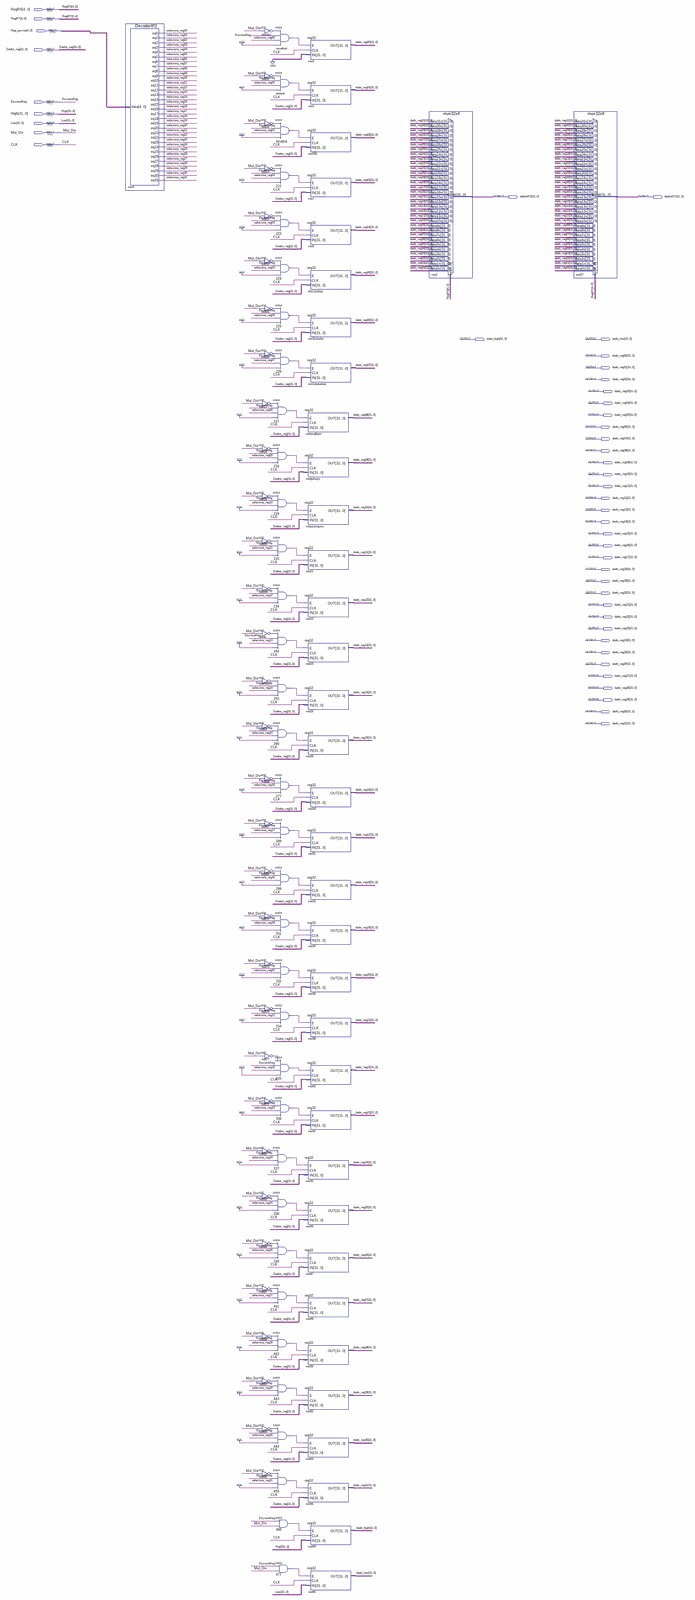
[diagram p0: schematic sheet, whole]
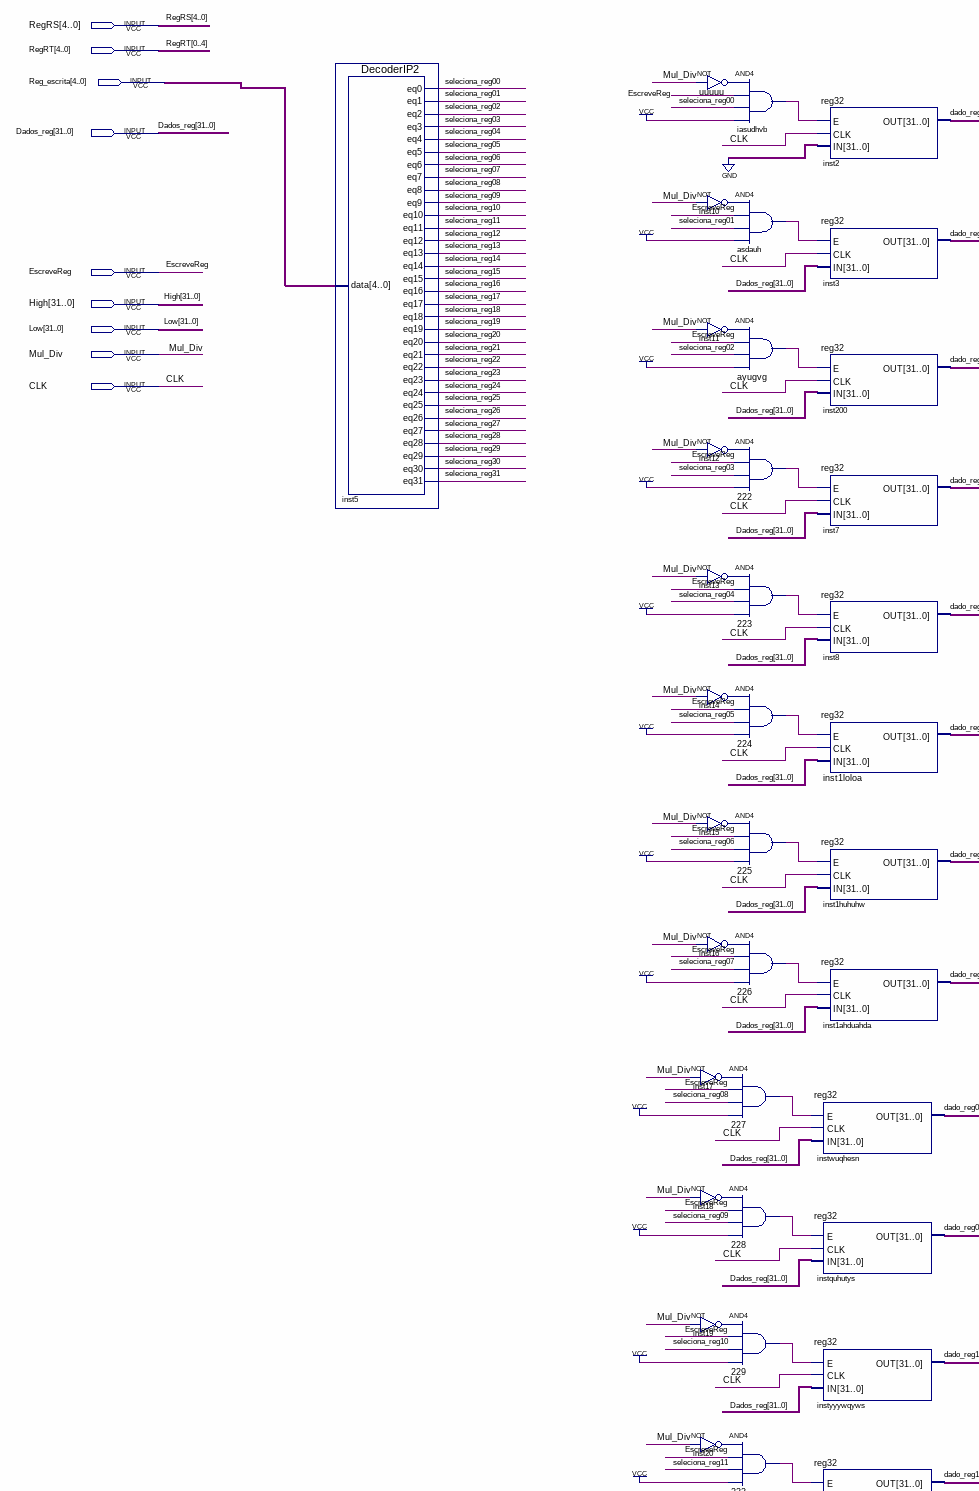
[diagram p1: schematic sheet, upper left part]
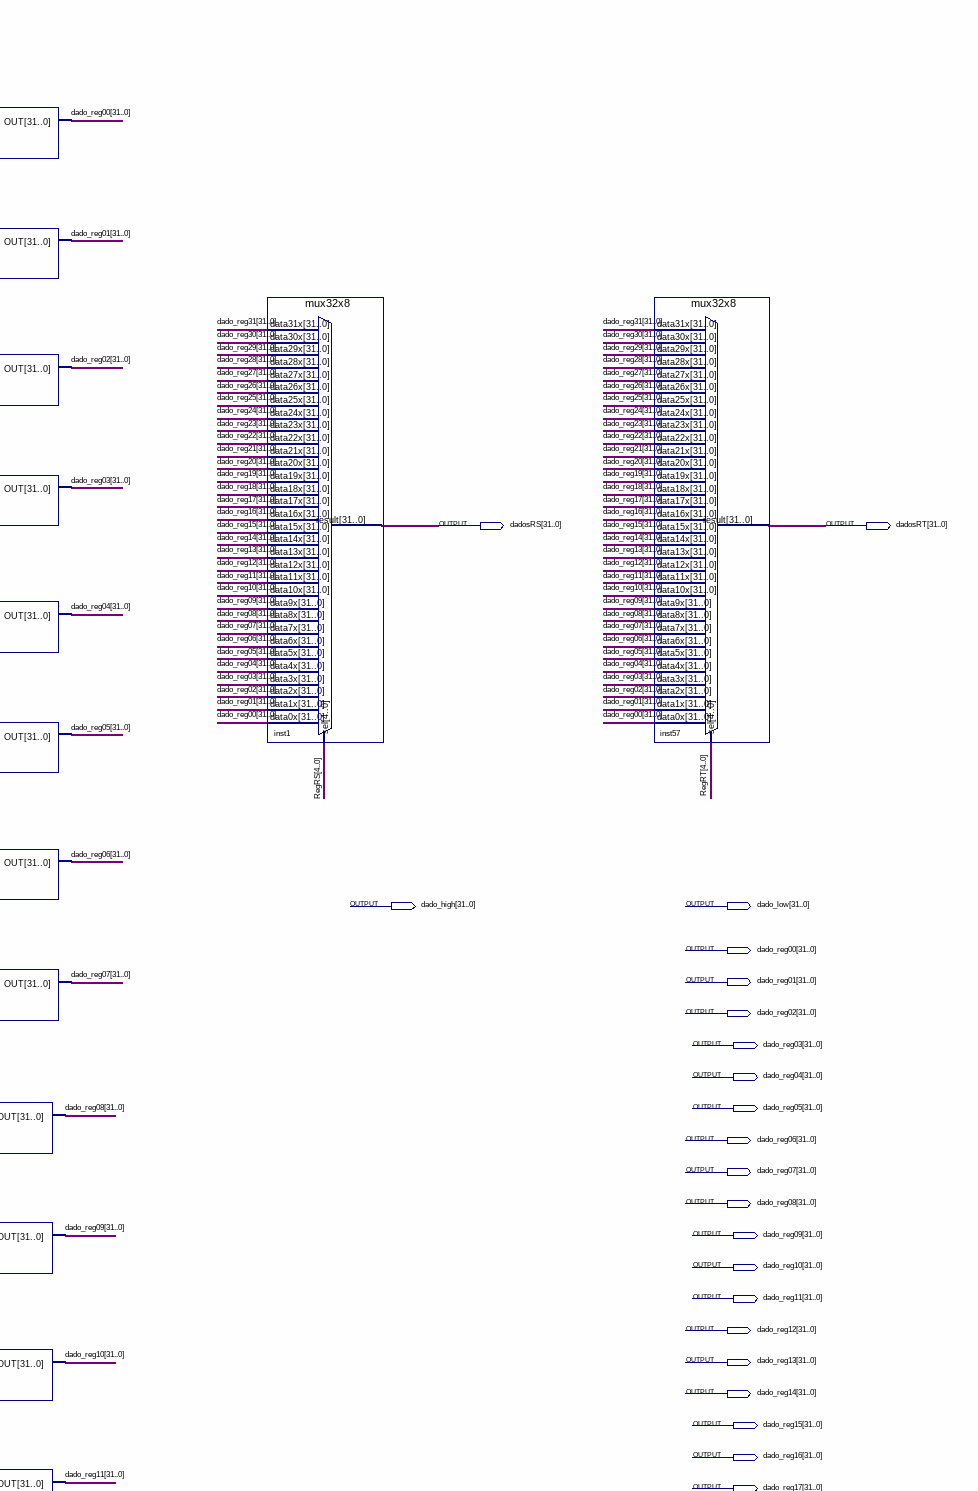
[diagram p2: schematic sheet, upper right part]
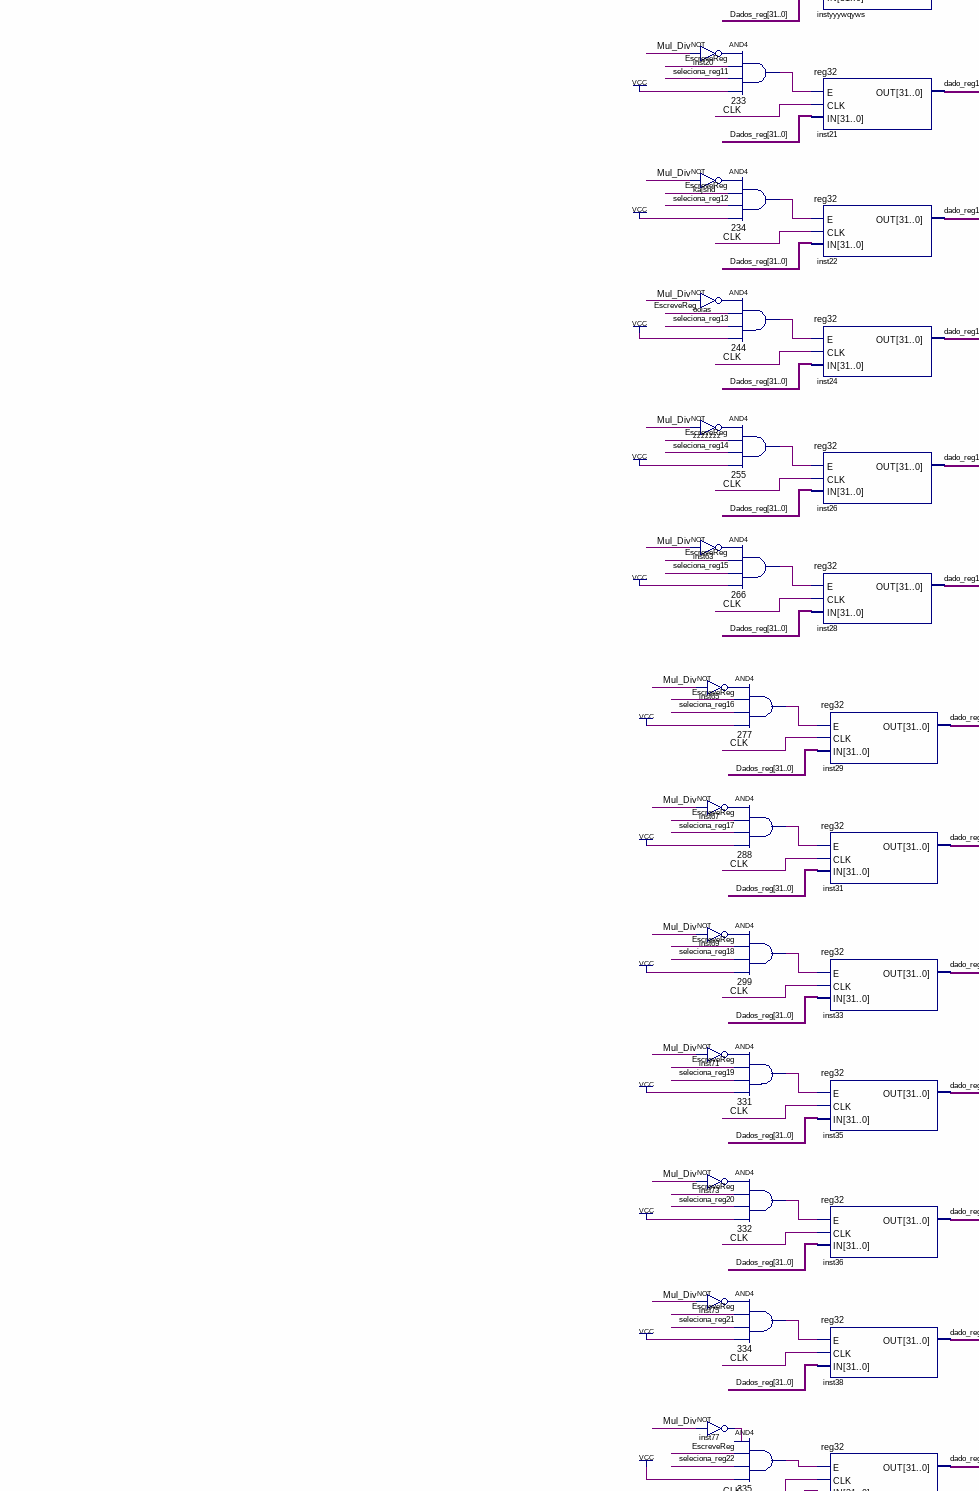
[diagram p3: schematic sheet, middle left part]
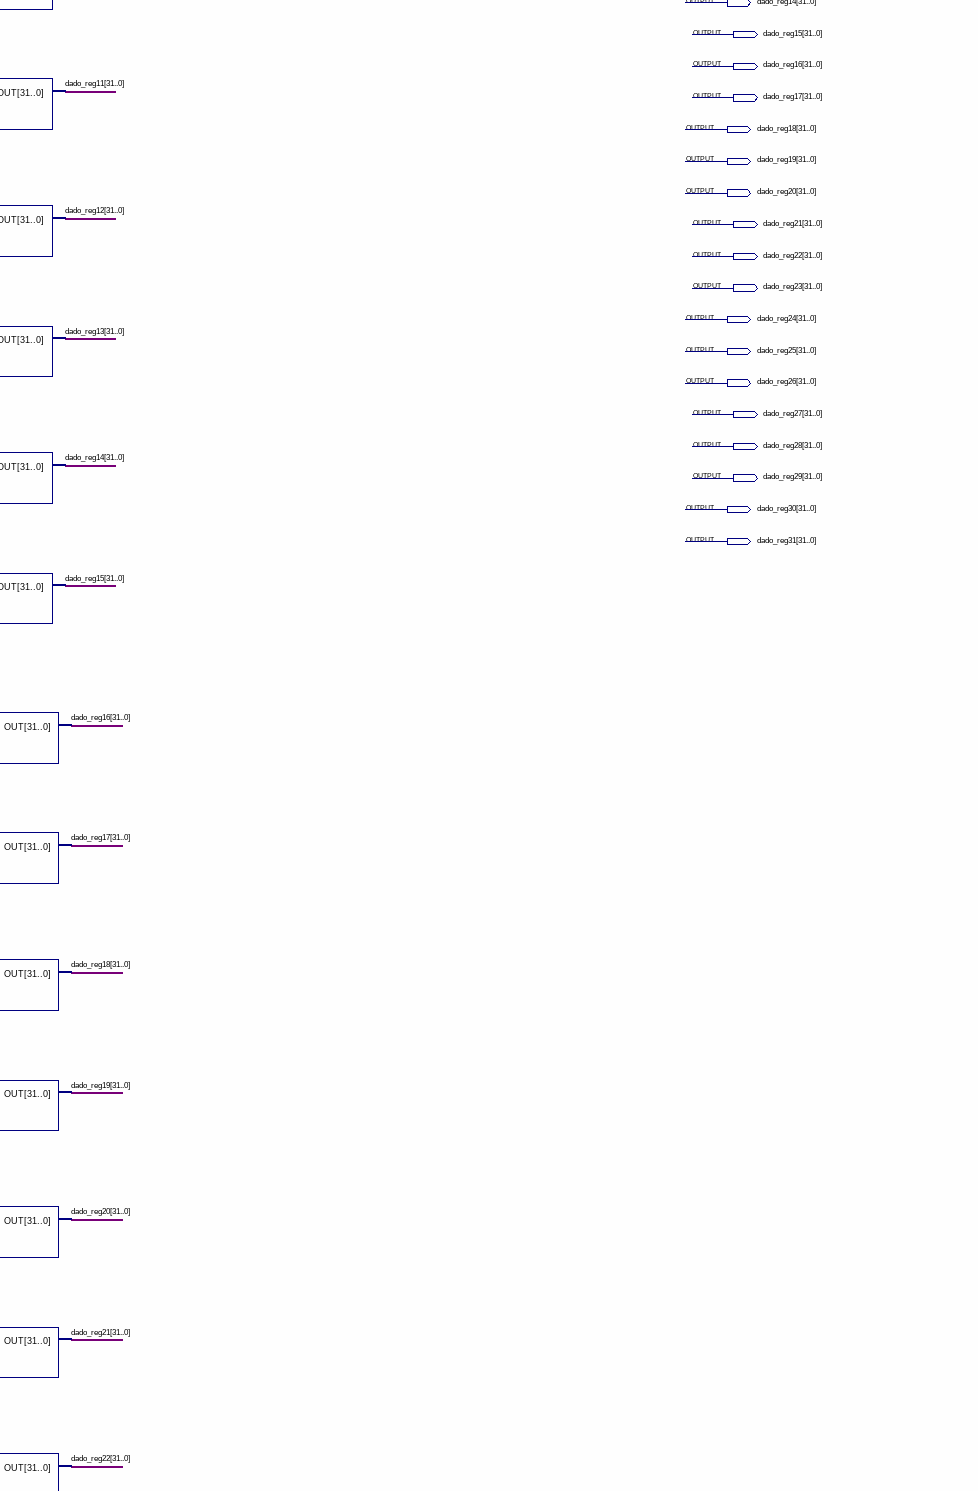
[diagram p4: schematic sheet, middle right part]
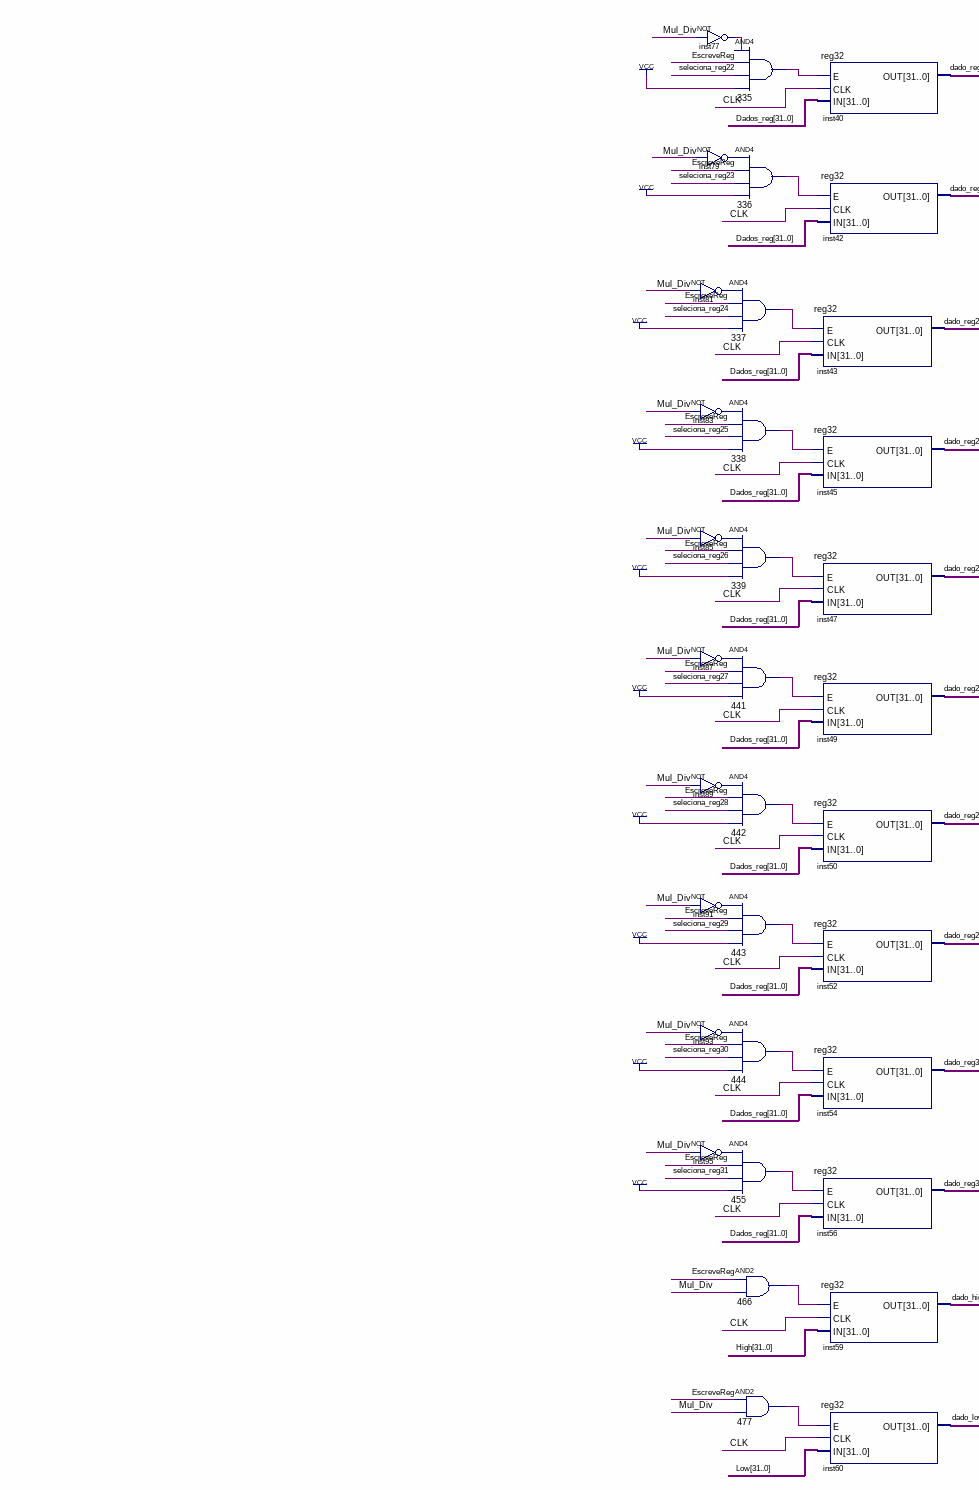
[diagram p5: schematic sheet, lower left part]
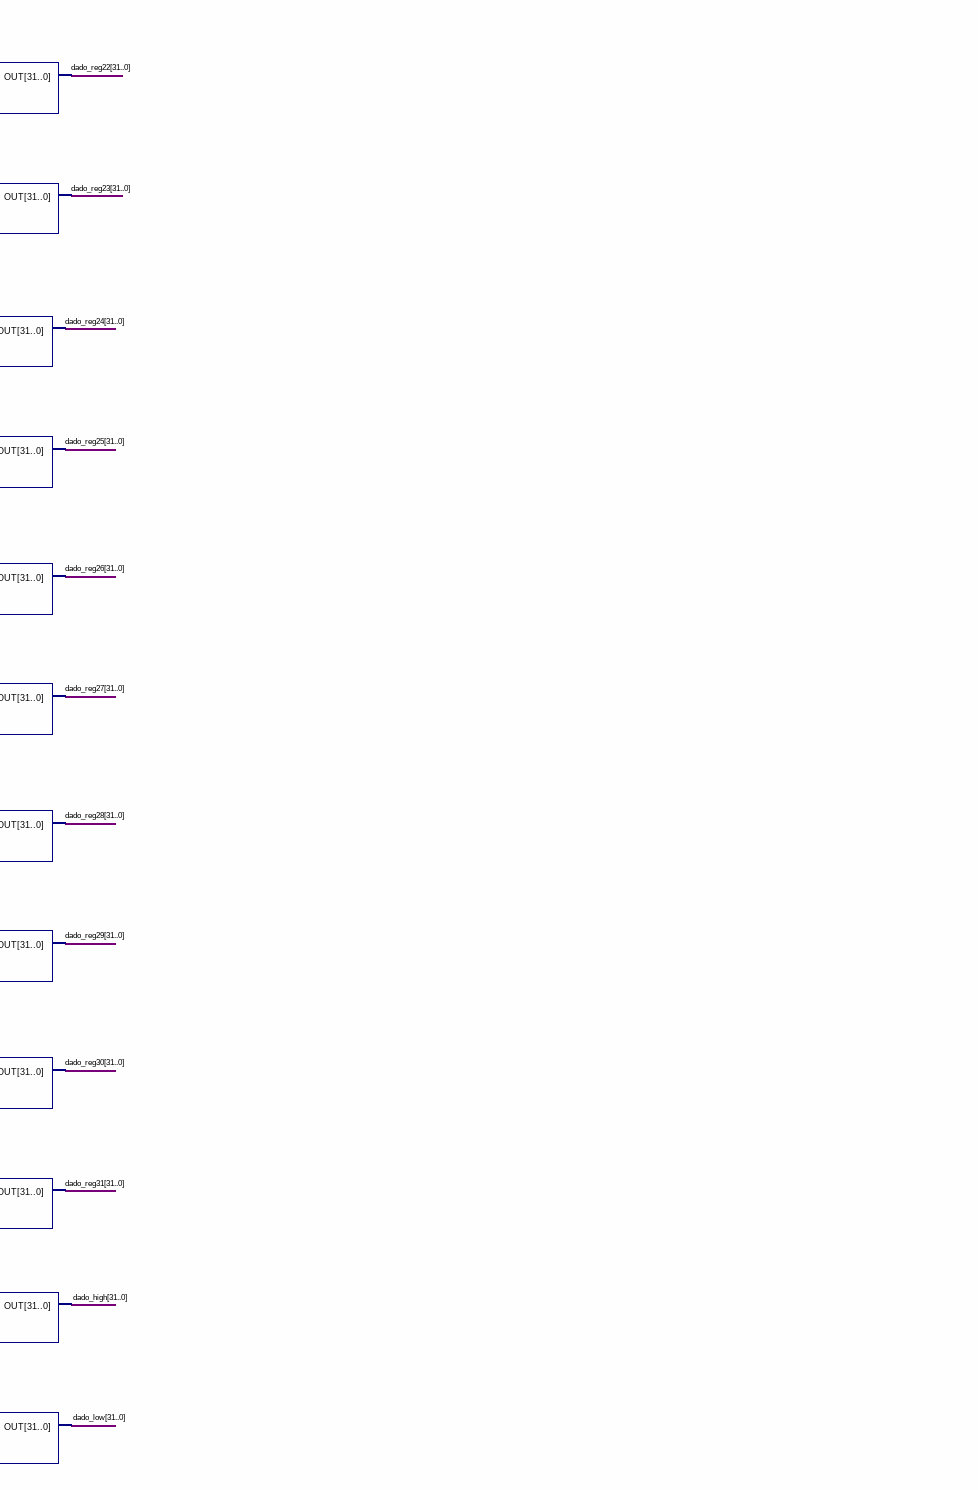
[diagram p6: schematic sheet, lower right part]
// Quartus schematic campo_registradores.bdf as structural Verilog: 103 symbols, 45 pins
module campo_registradores (
  input  [4:0] RegRS,
  input  [4:0] RegRT,
  input  [4:0] Reg_escrita,
  input  [31:0] Dados_reg,
  input  EscreveReg,
  input  [31:0] High,
  input  [31:0] Low,
  input  Mul_Div,
  input  CLK,
  output [31:0] dadosRS,
  output [31:0] dadosRT,
  output [31:0] dado_high,
  output [31:0] dado_low,
  output [31:0] dado_reg00,
  output [31:0] dado_reg01,
  output [31:0] dado_reg02,
  output [31:0] dado_reg03,
  output [31:0] dado_reg04,
  output [31:0] dado_reg05,
  output [31:0] dado_reg06,
  output [31:0] dado_reg07,
  output [31:0] dado_reg08,
  output [31:0] dado_reg09,
  output [31:0] dado_reg10,
  output [31:0] dado_reg11,
  output [31:0] dado_reg12,
  output [31:0] dado_reg13,
  output [31:0] dado_reg14,
  output [31:0] dado_reg15,
  output [31:0] dado_reg16,
  output [31:0] dado_reg17,
  output [31:0] dado_reg18,
  output [31:0] dado_reg19,
  output [31:0] dado_reg20,
  output [31:0] dado_reg21,
  output [31:0] dado_reg22,
  output [31:0] dado_reg23,
  output [31:0] dado_reg24,
  output [31:0] dado_reg25,
  output [31:0] dado_reg26,
  output [31:0] dado_reg27,
  output [31:0] dado_reg28,
  output [31:0] dado_reg29,
  output [31:0] dado_reg30,
  output [31:0] dado_reg31
);

  wire asdauh_out, ayugvg_out, iasudhvb_out, inst10_out, inst11_out, inst12_out, inst13_out, inst14_out,
       inst15_out, inst16_out, inst17_out, inst18_out, inst19_out, inst20_out, inst63_out, inst65_out,
       inst67_out, inst69_out, inst71_out, inst73_out, inst75_out, inst77_out, inst79_out, inst81_out,
       inst83_out, inst85_out, inst87_out, inst89_out, inst91_out, inst93_out, inst95_out, kajshd_out,
       n222_out, n223_out, n224_out, n225_out, n226_out, n227_out, n228_out, n229_out, n233_out, n234_out,
       n244_out, n255_out, n266_out, n277_out, n288_out, n299_out, n331_out, n332_out, n334_out, n335_out,
       n336_out, n337_out, n338_out, n339_out, n441_out, n442_out, n443_out, n444_out, n455_out, n466_out,
       n477_out, ooias_out, seleciona_reg00, seleciona_reg01, seleciona_reg02, seleciona_reg03,
       seleciona_reg04, seleciona_reg05, seleciona_reg06, seleciona_reg07, seleciona_reg08, seleciona_reg09,
       seleciona_reg10, seleciona_reg11, seleciona_reg12, seleciona_reg13, seleciona_reg14, seleciona_reg15,
       seleciona_reg16, seleciona_reg17, seleciona_reg18, seleciona_reg19, seleciona_reg20, seleciona_reg21,
       seleciona_reg22, seleciona_reg23, seleciona_reg24, seleciona_reg25, seleciona_reg26, seleciona_reg27,
       seleciona_reg28, seleciona_reg29, seleciona_reg30, seleciona_reg31, uuuuu_out, zzzzzzz_out;

  DecoderIP2 inst5 (
    .data(Reg_escrita), .eq0(seleciona_reg00), .eq1(seleciona_reg01), .eq2(seleciona_reg02),
    .eq3(seleciona_reg03), .eq4(seleciona_reg04), .eq5(seleciona_reg05), .eq6(seleciona_reg06),
    .eq7(seleciona_reg07), .eq8(seleciona_reg08), .eq9(seleciona_reg09), .eq10(seleciona_reg10),
    .eq11(seleciona_reg11), .eq12(seleciona_reg12), .eq13(seleciona_reg13), .eq14(seleciona_reg14),
    .eq15(seleciona_reg15), .eq16(seleciona_reg16), .eq17(seleciona_reg17), .eq18(seleciona_reg18),
    .eq19(seleciona_reg19), .eq20(seleciona_reg20), .eq21(seleciona_reg21), .eq22(seleciona_reg22),
    .eq23(seleciona_reg23), .eq24(seleciona_reg24), .eq25(seleciona_reg25), .eq26(seleciona_reg26),
    .eq27(seleciona_reg27), .eq28(seleciona_reg28), .eq29(seleciona_reg29), .eq30(seleciona_reg30),
    .eq31(seleciona_reg31));
  not uuuuu (uuuuu_out, Mul_Div);
  not inst10 (inst10_out, Mul_Div);
  not inst11 (inst11_out, Mul_Div);
  not inst12 (inst12_out, Mul_Div);
  not inst13 (inst13_out, Mul_Div);
  not inst14 (inst14_out, Mul_Div);
  not inst15 (inst15_out, Mul_Div);
  not inst16 (inst16_out, Mul_Div);
  not inst17 (inst17_out, Mul_Div);
  not inst18 (inst18_out, Mul_Div);
  not inst19 (inst19_out, Mul_Div);
  not inst20 (inst20_out, Mul_Div);
  not kajshd (kajshd_out, Mul_Div);
  not ooias (ooias_out, Mul_Div);
  not zzzzzzz (zzzzzzz_out, Mul_Div);
  not inst63 (inst63_out, Mul_Div);
  not inst65 (inst65_out, Mul_Div);
  not inst67 (inst67_out, Mul_Div);
  not inst69 (inst69_out, Mul_Div);
  not inst71 (inst71_out, Mul_Div);
  not inst73 (inst73_out, Mul_Div);
  not inst75 (inst75_out, Mul_Div);
  not inst77 (inst77_out, Mul_Div);
  not inst79 (inst79_out, Mul_Div);
  not inst81 (inst81_out, Mul_Div);
  not inst83 (inst83_out, Mul_Div);
  not inst85 (inst85_out, Mul_Div);
  not inst87 (inst87_out, Mul_Div);
  not inst89 (inst89_out, Mul_Div);
  not inst91 (inst91_out, Mul_Div);
  not inst93 (inst93_out, Mul_Div);
  not inst95 (inst95_out, Mul_Div);
  and iasudhvb (iasudhvb_out, uuuuu_out, EscreveReg, seleciona_reg00, 1'b1);
  and asdauh (asdauh_out, inst10_out, EscreveReg, seleciona_reg01, 1'b1);
  and ayugvg (ayugvg_out, inst11_out, EscreveReg, seleciona_reg02, 1'b1);
  and u_222 (n222_out, inst12_out, EscreveReg, seleciona_reg03, 1'b1);
  and u_223 (n223_out, inst13_out, EscreveReg, seleciona_reg04, 1'b1);
  and u_224 (n224_out, inst14_out, EscreveReg, seleciona_reg05, 1'b1);
  and u_225 (n225_out, inst15_out, EscreveReg, seleciona_reg06, 1'b1);
  and u_226 (n226_out, inst16_out, EscreveReg, seleciona_reg07, 1'b1);
  and u_227 (n227_out, inst17_out, EscreveReg, seleciona_reg08, 1'b1);
  and u_228 (n228_out, inst18_out, EscreveReg, seleciona_reg09, 1'b1);
  and u_229 (n229_out, inst19_out, EscreveReg, seleciona_reg10, 1'b1);
  and u_233 (n233_out, inst20_out, EscreveReg, seleciona_reg11, 1'b1);
  and u_234 (n234_out, kajshd_out, EscreveReg, seleciona_reg12, 1'b1);
  and u_244 (n244_out, ooias_out, EscreveReg, seleciona_reg13, 1'b1);
  and u_255 (n255_out, zzzzzzz_out, EscreveReg, seleciona_reg14, 1'b1);
  and u_266 (n266_out, inst63_out, EscreveReg, seleciona_reg15, 1'b1);
  and u_277 (n277_out, inst65_out, EscreveReg, seleciona_reg16, 1'b1);
  and u_288 (n288_out, inst67_out, EscreveReg, seleciona_reg17, 1'b1);
  and u_299 (n299_out, inst69_out, EscreveReg, seleciona_reg18, 1'b1);
  and u_331 (n331_out, inst71_out, EscreveReg, seleciona_reg19, 1'b1);
  and u_332 (n332_out, inst73_out, EscreveReg, seleciona_reg20, 1'b1);
  and u_334 (n334_out, inst75_out, EscreveReg, seleciona_reg21, 1'b1);
  and u_335 (n335_out, inst77_out, EscreveReg, seleciona_reg22, 1'b1);
  and u_336 (n336_out, inst79_out, EscreveReg, seleciona_reg23, 1'b1);
  and u_337 (n337_out, inst81_out, EscreveReg, seleciona_reg24, 1'b1);
  and u_338 (n338_out, inst83_out, EscreveReg, seleciona_reg25, 1'b1);
  and u_339 (n339_out, inst85_out, EscreveReg, seleciona_reg26, 1'b1);
  and u_441 (n441_out, inst87_out, EscreveReg, seleciona_reg27, 1'b1);
  and u_442 (n442_out, inst89_out, EscreveReg, seleciona_reg28, 1'b1);
  and u_443 (n443_out, inst91_out, EscreveReg, seleciona_reg29, 1'b1);
  and u_444 (n444_out, inst93_out, EscreveReg, seleciona_reg30, 1'b1);
  and u_455 (n455_out, inst95_out, EscreveReg, seleciona_reg31, 1'b1);
  and u_466 (n466_out, EscreveReg, Mul_Div);
  and u_477 (n477_out, EscreveReg, Mul_Div);
  reg32 inst2 (.E(iasudhvb_out), .CLK(CLK), .IN({32{1'b0}}), .OUT(dado_reg00));
  reg32 inst3 (.E(asdauh_out), .CLK(CLK), .IN(Dados_reg), .OUT(dado_reg01));
  reg32 inst200 (.E(ayugvg_out), .CLK(CLK), .IN(Dados_reg), .OUT(dado_reg02));
  reg32 inst7 (.E(n222_out), .CLK(CLK), .IN(Dados_reg), .OUT(dado_reg03));
  reg32 inst8 (.E(n223_out), .CLK(CLK), .IN(Dados_reg), .OUT(dado_reg04));
  reg32 inst1loloa (.E(n224_out), .CLK(CLK), .IN(Dados_reg), .OUT(dado_reg05));
  reg32 inst1huhuhw (.E(n225_out), .CLK(CLK), .IN(Dados_reg), .OUT(dado_reg06));
  reg32 inst1ahduahda (.E(n226_out), .CLK(CLK), .IN(Dados_reg), .OUT(dado_reg07));
  reg32 instwuqhesn (.E(n227_out), .CLK(CLK), .IN(Dados_reg), .OUT(dado_reg08));
  reg32 instquhutys (.E(n228_out), .CLK(CLK), .IN(Dados_reg), .OUT(dado_reg09));
  reg32 instyyywqyws (.E(n229_out), .CLK(CLK), .IN(Dados_reg), .OUT(dado_reg10));
  reg32 inst21 (.E(n233_out), .CLK(CLK), .IN(Dados_reg), .OUT(dado_reg11));
  reg32 inst22 (.E(n234_out), .CLK(CLK), .IN(Dados_reg), .OUT(dado_reg12));
  reg32 inst24 (.E(n244_out), .CLK(CLK), .IN(Dados_reg), .OUT(dado_reg13));
  reg32 inst26 (.E(n255_out), .CLK(CLK), .IN(Dados_reg), .OUT(dado_reg14));
  reg32 inst28 (.E(n266_out), .CLK(CLK), .IN(Dados_reg), .OUT(dado_reg15));
  reg32 inst29 (.E(n277_out), .CLK(CLK), .IN(Dados_reg), .OUT(dado_reg16));
  reg32 inst31 (.E(n288_out), .CLK(CLK), .IN(Dados_reg), .OUT(dado_reg17));
  reg32 inst33 (.E(n299_out), .CLK(CLK), .IN(Dados_reg), .OUT(dado_reg18));
  reg32 inst35 (.E(n331_out), .CLK(CLK), .IN(Dados_reg), .OUT(dado_reg19));
  reg32 inst36 (.E(n332_out), .CLK(CLK), .IN(Dados_reg), .OUT(dado_reg20));
  reg32 inst38 (.E(n334_out), .CLK(CLK), .IN(Dados_reg), .OUT(dado_reg21));
  reg32 inst40 (.E(n335_out), .CLK(CLK), .IN(Dados_reg), .OUT(dado_reg22));
  reg32 inst42 (.E(n336_out), .CLK(CLK), .IN(Dados_reg), .OUT(dado_reg23));
  reg32 inst43 (.E(n337_out), .CLK(CLK), .IN(Dados_reg), .OUT(dado_reg24));
  reg32 inst45 (.E(n338_out), .CLK(CLK), .IN(Dados_reg), .OUT(dado_reg25));
  reg32 inst47 (.E(n339_out), .CLK(CLK), .IN(Dados_reg), .OUT(dado_reg26));
  reg32 inst49 (.E(n441_out), .CLK(CLK), .IN(Dados_reg), .OUT(dado_reg27));
  reg32 inst50 (.E(n442_out), .CLK(CLK), .IN(Dados_reg), .OUT(dado_reg28));
  reg32 inst52 (.E(n443_out), .CLK(CLK), .IN(Dados_reg), .OUT(dado_reg29));
  reg32 inst54 (.E(n444_out), .CLK(CLK), .IN(Dados_reg), .OUT(dado_reg30));
  reg32 inst56 (.E(n455_out), .CLK(CLK), .IN(Dados_reg), .OUT(dado_reg31));
  reg32 inst59 (.E(n466_out), .CLK(CLK), .IN(High), .OUT(dado_high));
  reg32 inst60 (.E(n477_out), .CLK(CLK), .IN(Low), .OUT(dado_low));
  mux32x8 inst1 (
    .data31x(dado_reg31), .data30x(dado_reg30), .data29x(dado_reg29), .data28x(dado_reg28),
    .data27x(dado_reg27), .data26x(dado_reg26), .data25x(dado_reg25), .data24x(dado_reg24),
    .data23x(dado_reg23), .data22x(dado_reg22), .data21x(dado_reg21), .data20x(dado_reg20),
    .data19x(dado_reg19), .data18x(dado_reg18), .data17x(dado_reg17), .data16x(dado_reg16),
    .data15x(dado_reg15), .data14x(dado_reg14), .data13x(dado_reg13), .data12x(dado_reg12),
    .data11x(dado_reg11), .data10x(dado_reg10), .data9x(dado_reg09), .data8x(dado_reg08),
    .data7x(dado_reg07), .data6x(dado_reg06), .data5x(dado_reg05), .data4x(dado_reg04), .data3x(dado_reg03),
    .data2x(dado_reg02), .data1x(dado_reg01), .data0x(dado_reg00), .sel(RegRS), .result(dadosRS));
  mux32x8 inst57 (
    .data31x(dado_reg31), .data30x(dado_reg30), .data29x(dado_reg29), .data28x(dado_reg28),
    .data27x(dado_reg27), .data26x(dado_reg26), .data25x(dado_reg25), .data24x(dado_reg24),
    .data23x(dado_reg23), .data22x(dado_reg22), .data21x(dado_reg21), .data20x(dado_reg20),
    .data19x(dado_reg19), .data18x(dado_reg18), .data17x(dado_reg17), .data16x(dado_reg16),
    .data15x(dado_reg15), .data14x(dado_reg14), .data13x(dado_reg13), .data12x(dado_reg12),
    .data11x(dado_reg11), .data10x(dado_reg10), .data9x(dado_reg09), .data8x(dado_reg08),
    .data7x(dado_reg07), .data6x(dado_reg06), .data5x(dado_reg05), .data4x(dado_reg04), .data3x(dado_reg03),
    .data2x(dado_reg02), .data1x(dado_reg01), .data0x(dado_reg00), .sel(RegRT), .result(dadosRT));
endmodule
